# EAGLE design ai_breakout_TXB0108 (EAGLE 7.1.0)
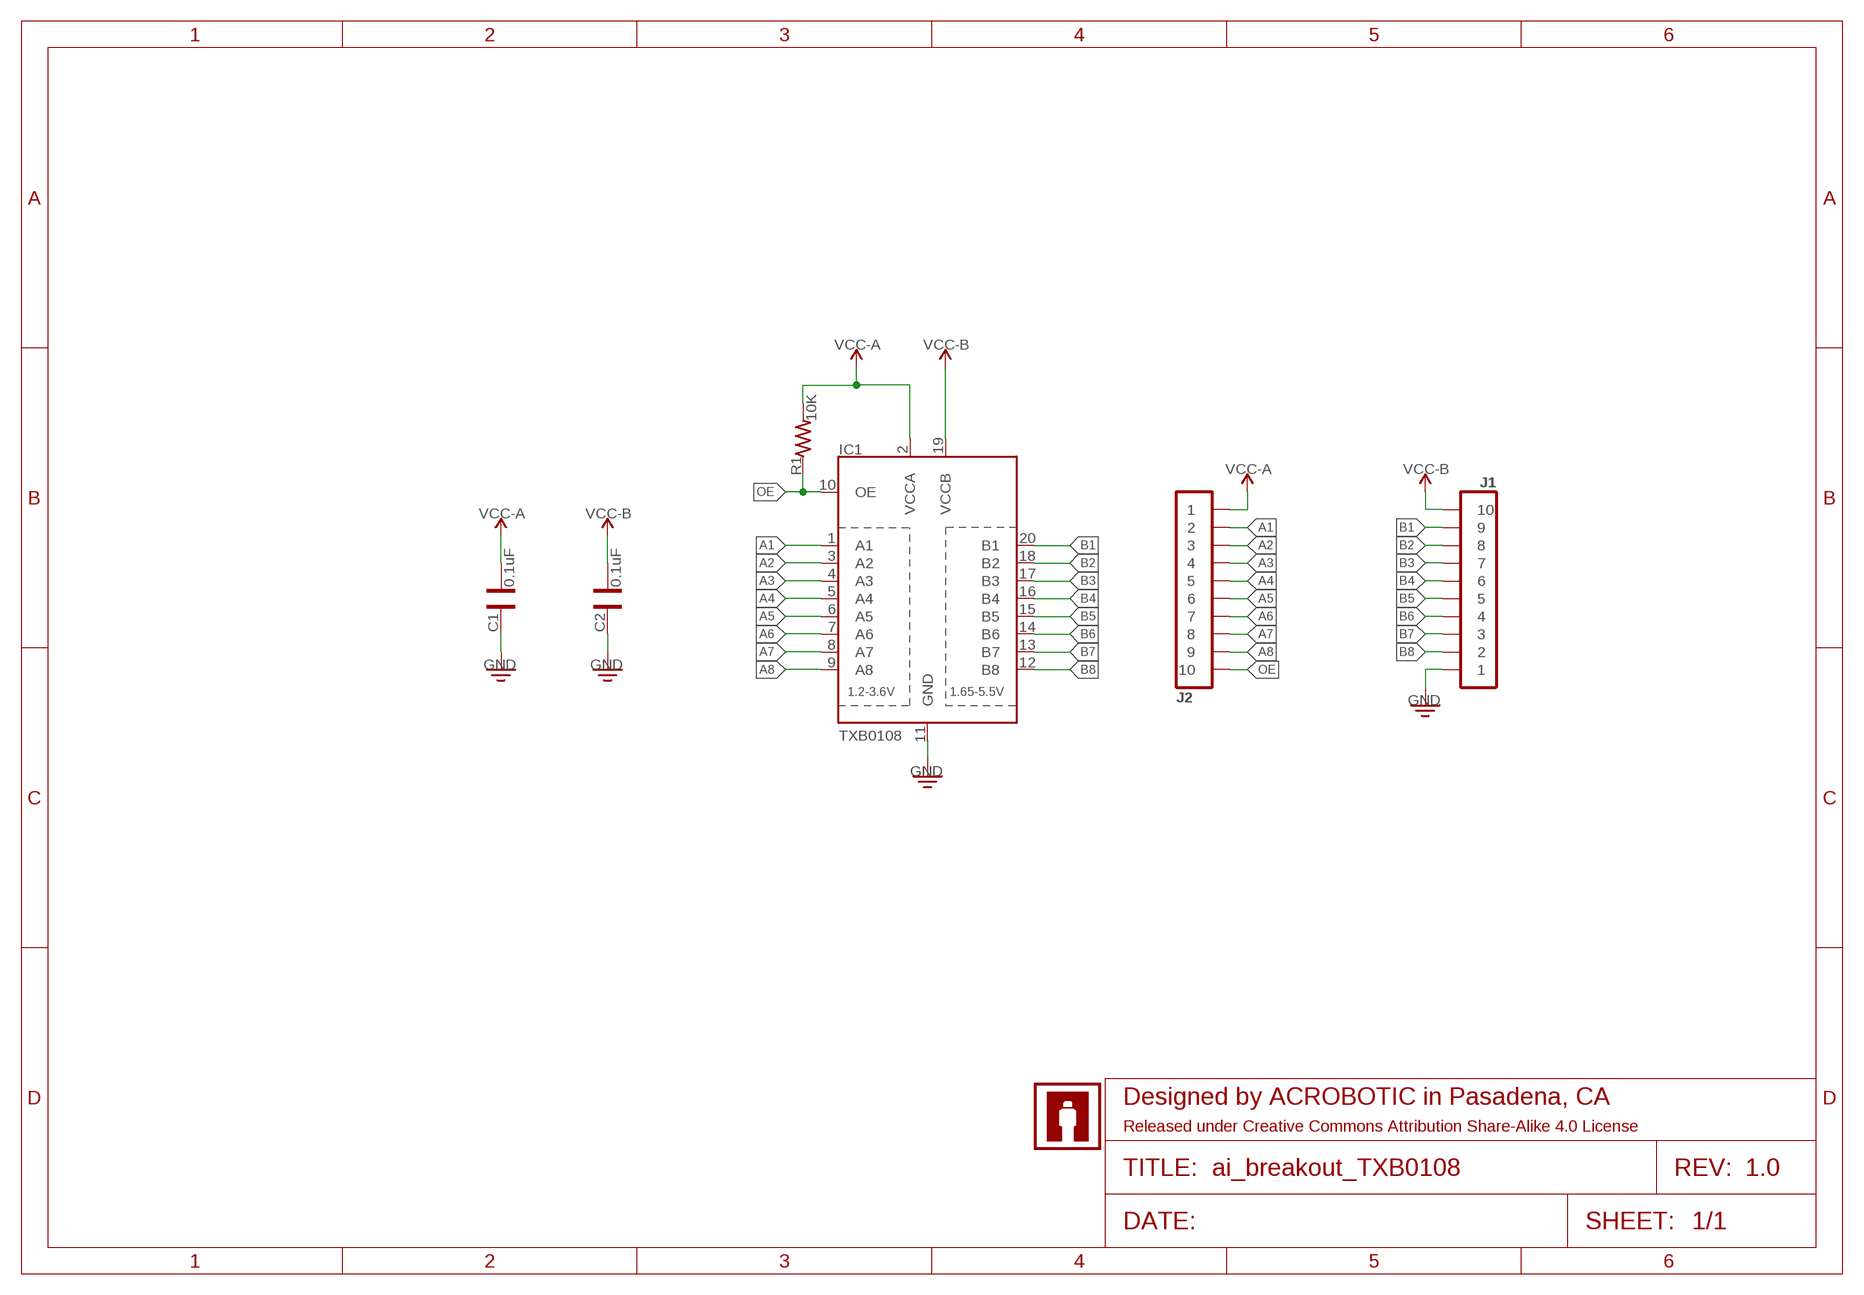
[diagram p0: schematic, sheet 1]

## Parts
C1  0.1uF  CAP0603  [CAP-0603]
C2  0.1uF  CAP0603  [CAP-0603]
FRAME1  FRAME-LETTER  [CREATIVE-COMMONS]
IC1  TXB0108  [TSSOP20]
J1  1X10  [1X10]
J2  1X10NOFIRST  [1X10-NOFIRST]
R1  10K  RES0603  [RES-0603]
U$1  AI-LOGOXS  [AI-LOGO-XS]
U$2  AI-LOGOXS  [AI-LOGO-XS]

## Nets
A1: IC1.1(A1) J2.2
A2: IC1.3(A2) J2.3
A3: IC1.4(A3) J2.4
A4: IC1.5(A4) J2.5
A5: IC1.6(A5) J2.6
A6: IC1.7(A6) J2.7
A7: IC1.8(A7) J2.8
A8: IC1.9(A8) J2.9
B1: IC1.20(B1) J1.9
B2: IC1.18(B2) J1.8
B3: IC1.17(B3) J1.7
B4: IC1.16(B4) J1.6
B5: IC1.15(B5) J1.5
B6: IC1.14(B6) J1.4
B7: IC1.13(B7) J1.3
B8: IC1.12(B8) J1.2
GND: C1.2 C2.2 IC1.11(GND) J1.1
OE: IC1.10(OE) J2.10 R1.1
VCC-A: C1.1 IC1.2(VCCA) J2.1 R1.2
VCC-B: C2.1 IC1.19(VCCB) J1.10

## Library data of the parts
C1 C2 = Ai_Passives:CAP
FRAME1 = Ai_Miscellany:FRAME-LETTER: Schematic Frame A4 (8.5x11) US Letter frame based on the built-in A4-LOC frame.; REV: 1.0
IC1 = Ai_IC:TXB0108: 8-Bit Bi-Directional Level Shifter 1.2V-3.6V (VCCA) to 1.65V-5.5V (VCCB) bi-directional level shifter with auto direction sensing. Max data rate - VCCA 1.8V: 20Mbps (50ns), VCCA 3.3V: 100Mbps (10ns) Digikey: 296-21527-1-ND
J1 J2 = Ai_Connectors:1X10
R1 = Ai_Passives:RES: Part # blah Digikey
U$1 U$2 = Ai_Miscellany:AI-LOGO

## Board
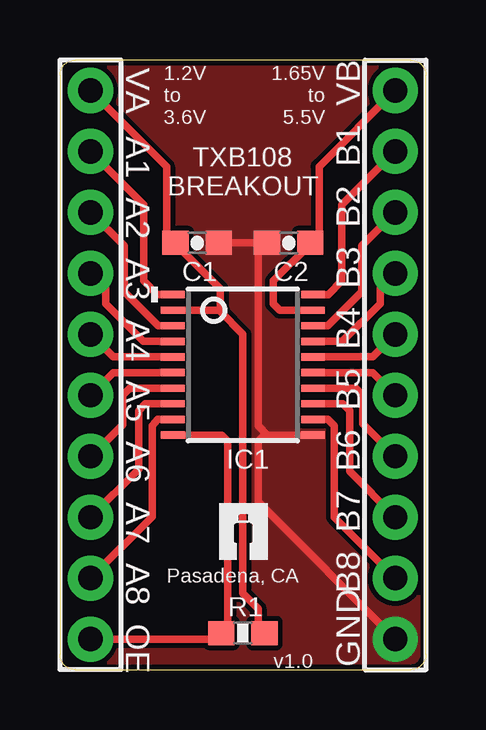
[diagram p1: board, top side]
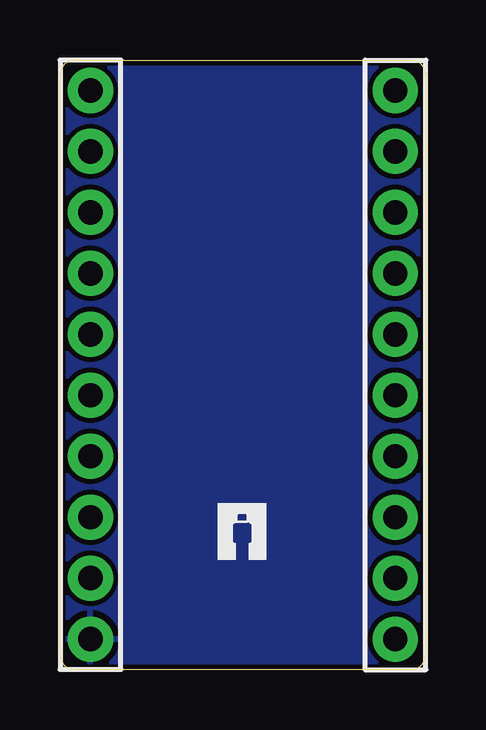
[diagram p2: board, bottom side, seen from below]

Size 15.24 x 25.4 mm. Coordinates in mm from the lower left corner, seen from the top.
Outline: 0.64,0 14.61,0 arc90 15.24,0.64 15.24,24.77 arc90 14.61,25.4 0.64,25.4 arc90 0,24.77 0,0.64 arc90 0.64,0
Copper layers (1*16): Top 0.035mm / dielectric 1.5mm / Bottom 0.035mm
Design rules "ai_2layer": minimum track width 7mil, minimum drill 15mil, track to track 8mil, track to pad 8mil, pad to pad 8mil, via to via 8mil, smd to smd 8mil, copper to edge 8mil, drill to drill 8mil, minimum pad ring 12mil, minimum via ring 10mil, stop-mask expansion 4mil, vias tented up to drill 20mil, thermal gap 10mil

### Footprints (pad centres in the part's own frame; a part is rotated, then mirrored left to right if it is on the bottom)
CAP-0603 = smd 1.1 x 1: 1 -0.9,0; 2 0.9,0
TSSOP20 = smd 0.305 x 0.991: 1 -2.925,-2.918; 2 -2.275,-2.918; 3 -1.625,-2.918; 4 -0.975,-2.918; 5 -0.325,-2.918; 6 0.325,-2.918; 7 0.975,-2.918; 8 1.625,-2.918; 9 2.275,-2.918; 10 2.925,-2.918; 11 2.925,2.918; 12 2.275,2.918; 13 1.625,2.918; 14 0.975,2.918; 15 0.325,2.918; 16 -0.325,2.918; 17 -0.975,2.918; 18 -1.625,2.918; 19 -2.275,2.918; 20 -2.925,2.918
1X10 = drill 1.016 pad 1.88: 1 -11.43,0; 2 -8.89,0; 3 -6.35,0; 4 -3.81,0; 5 -1.27,0; 6 1.27,0; 7 3.81,0; 8 6.35,0; 9 8.89,0; 10 11.43,0
1X10-NOFIRST = drill 1.016 pad 1.88: 1 -11.43,0; 2 -8.89,0; 3 -6.35,0; 4 -3.81,0; 5 -1.27,0; 6 1.27,0; 7 3.81,0; 8 6.35,0; 9 8.89,0; 10 11.43,0
RES-0603 = smd 1.1 x 1: 1 -0.9,0; 2 0.9,0

### Placement (x,y rotation side)
C1  5.71,17.78 0 top
C2  9.53,17.78 180 top
FRAME1  7.62,-1.27 0 top
IC1  7.62,12.7 270 top
J1  13.97,12.7 90 top
J2  1.27,12.7 270 top
R1  7.62,1.52 0 top
U$1  6.65,4.57 0 top
U$2  8.64,4.57 0 bottom

### Tracks (layer width: path | path; a pad name or v marks a point on that pad's centre or on a via)
A1
  Top 0.305: IC1.1 4.06,15.62 3.49,16.19 3.49,19.37 J2.2
A2
  Top 0.305: IC1.3 4.09,14.32 2.67,15.75 2.67,17.65 J2.3
A3
  Top 0.305: IC1.4 3.47,13.68 1.91,15.24 1.91,15.88 J2.4
A4
  Top 0.305: IC1.5 2.21,13.03 J2.5
A5
  Top 0.305: IC1.6 2.21,12.38 J2.6
A6
  Top 0.305: IC1.7 2.91,11.72 2.62,11.43 2.62,10.21 1.29,8.89 J2.7
A7
  Top 0.305: IC1.8 3.56,11.07 3.28,10.79 3.28,8.36 J2.8
A8
  Top 0.305: IC1.9 4.08,10.43 3.83,10.16 3.83,6.38 J2.9
B1
  Top 0.305: IC1.20 11.18,15.62 11.75,16.19 11.75,19.37 J1.9
B2
  Top 0.305: IC1.18 11.15,14.32 12.57,15.75 12.57,17.65 J1.8
B3
  Top 0.305: IC1.17 11.77,13.68 13.34,15.24 13.34,15.88 J1.7
B4
  Top 0.305: IC1.16 13.03,13.03 J1.6
B5
  Top 0.305: IC1.15 13.03,12.38 J1.5
B6
  Top 0.305: IC1.14 12.33,11.72 12.62,11.43 12.62,10.24 J1.4
B7
  Top 0.305: IC1.13 11.79,11.07 12.06,10.79 12.06,8.26 J1.3
B8
  Top 0.305: IC1.12 11.16,10.43 11.43,10.16 11.43,6.35 J1.2
GND
  Top 0.305: 8.64,9.78 8.51,9.78 8.26,9.53 8.26,6.99 J1.1 | IC1.11 8.64,9.78 | 8.64,9.78 8.26,10.16 8.26,17.36 C2.2 C1.2
  pour Top (no thermals): 0,25.4 15.24,25.4 15.24,0 0,0
  pour Bottom: 0,25.4 15.24,25.4 15.24,0 0,0
OE
  Top 0.305: 6.6,1.27 R1.1 | IC1.10 6.74,9.78 6.99,9.53 6.99,1.49 R1.1 | J2.10 6.47,1.27 R1.1
VCC-A
  Top 0.305: IC1.2 6.62,14.97 | 6.62,14.97 6.72,14.97 | 6.62,14.97 6.67,14.92 | 6.67,14.92 7.62,13.97 7.62,3.17 8.26,2.54 8.26,1.49 R1.2 | 6.67,14.92 6.67,15.88 4.87,17.68 C1.1 4.45,18.2 4.45,20.95 J2.1
VCC-B
  Top 0.305: IC1.19 9.15,14.97 8.89,15.24 8.89,16.19 10.38,17.68 C2.1 10.79,18.2 10.79,20.95 J1.10

### Text on the board
tPlace: VA | 1.2V / to / 3.6V | 1.65V / to / 5.5V | VB | A1 | TXB108 / BREAKOUT | B1 | A2 | B2 | A3 | B3 | A4 | B4 | A5 | B5 | A6 | B6 | A7 | B7 | A8 | Pasadena, CA | B8 | OE | v1.0 | GND
tDocu: @MakerBro